# Altium schematic sheet Sheet_Connect.SchDoc
size A2
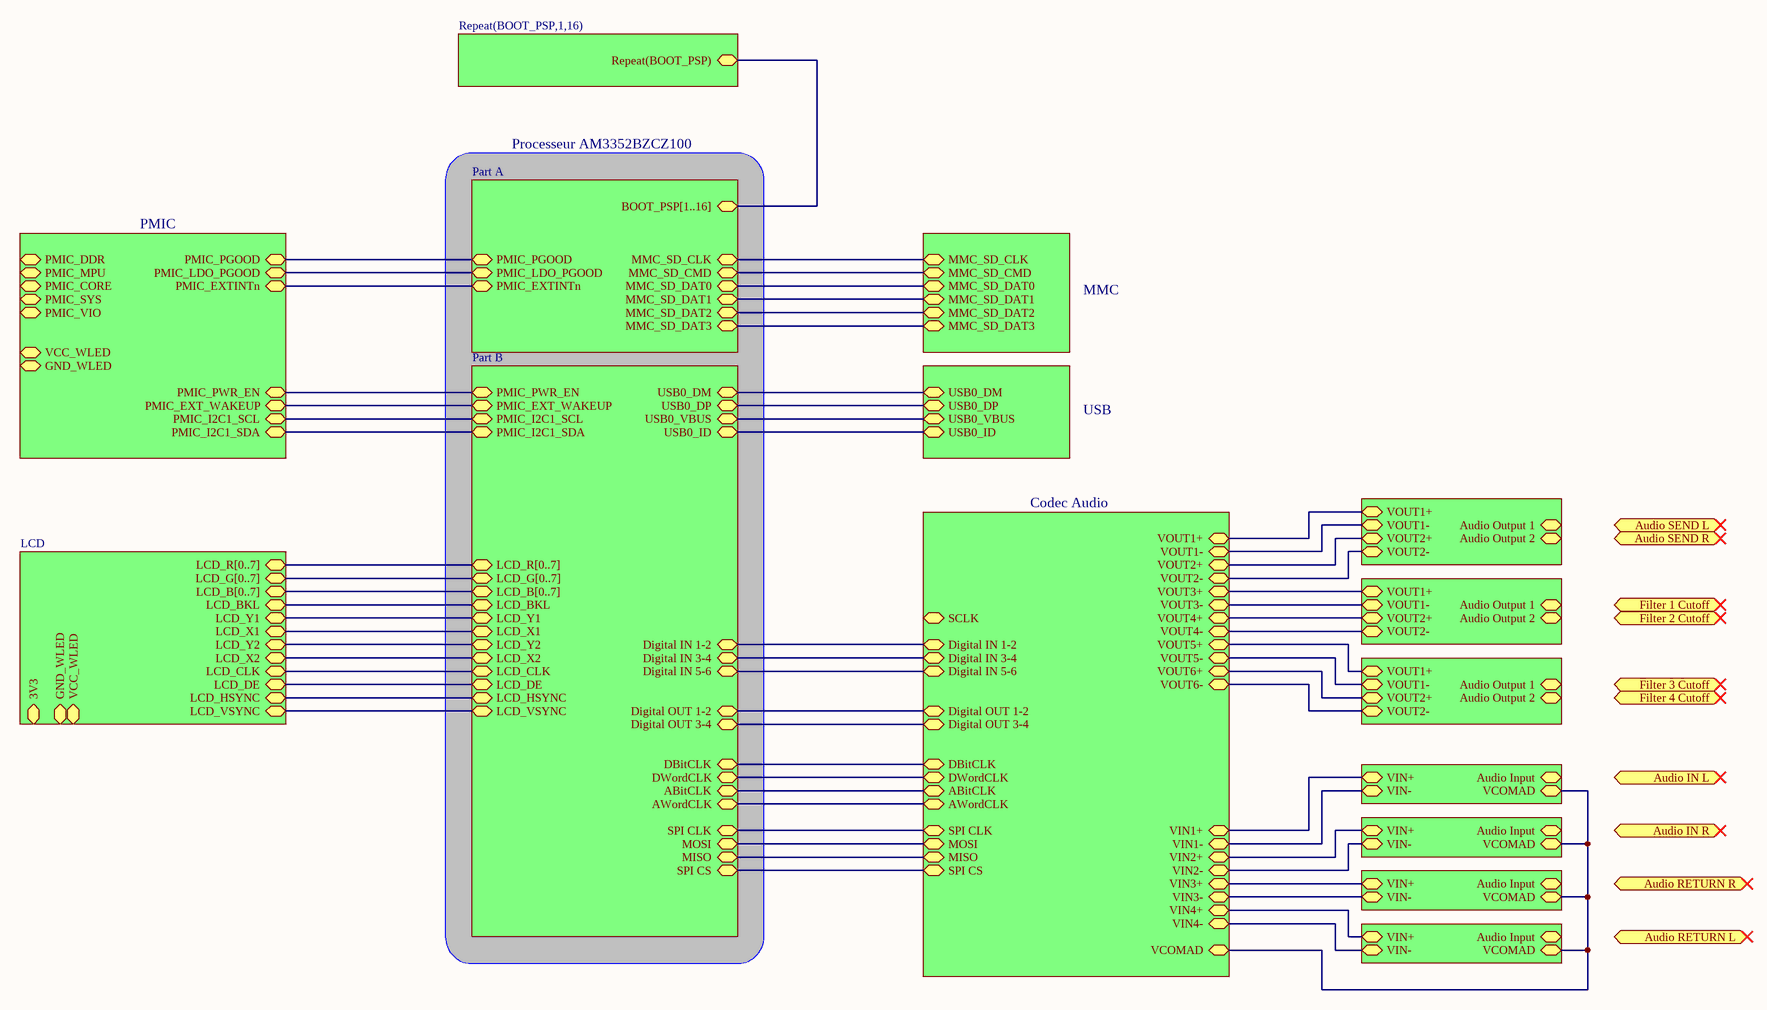
[diagram p0: Sheet_Connect.SchDoc]

## Sub-sheets
Audio Input L = Sh_Input.SchDoc: VIN+, VIN-, VCOMAD, Audio Input
Audio Input R = Sh_Input.SchDoc: VIN+, VIN-, VCOMAD, Audio Input
Audio Output = Sh_Output.SchDoc: VOUT1+, VOUT1-, VOUT2+, VOUT2-, Audio Output 1, Audio Output 2
Audio Output = Sh_Output.SchDoc: VOUT1+, VOUT1-, VOUT2+, VOUT2-, Audio Output 1, Audio Output 2
Audio Output = Sh_Output.SchDoc: VOUT1+, VOUT1-, VOUT2+, VOUT2-, Audio Output 1, Audio Output 2
Audio Repeat L = Sh_Input.SchDoc: VIN+, VIN-, VCOMAD, Audio Input
Audio Repeat R = Sh_Input.SchDoc: VIN+, VIN-, VCOMAD, Audio Input
Codec Audio = Sh_ADC-DAC_Main.SchDoc: VOUT1+, VOUT1-, VOUT2+, VOUT2-, VOUT3+, VOUT3-, VOUT4+, VOUT4-, VOUT5+, VOUT5-, VOUT6+, VOUT6-, VIN1+, VIN1-, VIN2+, VIN2-, VIN3+, VIN3-, VIN4+, VIN4-, VCOMAD, SCLK, Digital IN 1-2, Digital IN 3-4, Digital IN 5-6, Digital OUT 1-2, Digital OUT 3-4, DBitCLK, DWordCLK, ABitCLK, AWordCLK, SPI CLK, MOSI, MISO, SPI CS
LCD = LCD.SchDoc: 3V3, LCD_R[0..7], LCD_G[0..7], LCD_B[0..7], LCD_BKL, LCD_Y1, LCD_X1, LCD_Y2, LCD_X2, LCD_CLK, LCD_DE, GND_WLED, VCC_WLED, LCD_HSYNC, LCD_VSYNC
MMC = PROC_partA_(SRAM,NAND,LCD).SchDoc: MMC_SD_CMD, MMC_SD_DAT0, MMC_SD_DAT1, MMC_SD_DAT2, MMC_SD_DAT3, MMC_SD_CLK
Part A = PROC_partA_(SRAM,NAND,LCD).SchDoc: PMIC_PGOOD, PMIC_LDO_PGOOD, PMIC_EXTINTn, MMC_SD_CLK, MMC_SD_CMD, MMC_SD_DAT0, MMC_SD_DAT1, MMC_SD_DAT2, MMC_SD_DAT3, BOOT_PSP[1..16]
Part B = PROC_partB_(LCD).SchDoc: PMIC_EXT_WAKEUP, PMIC_PWR_EN, PMIC_I2C1_SCL, PMIC_I2C1_SDA, USB0_DM, USB0_DP, USB0_VBUS, USB0_ID, LCD_R[0..7], LCD_G[0..7], LCD_B[0..7], LCD_BKL, LCD_Y1, LCD_X1, LCD_Y2, LCD_X2, LCD_CLK, LCD_DE, LCD_HSYNC, LCD_VSYNC, Digital IN 1-2, Digital IN 3-4, Digital IN 5-6, Digital OUT 1-2, Digital OUT 3-4, DBitCLK, DWordCLK, ABitCLK, AWordCLK, SPI CLK, MOSI, MISO, SPI CS
PMIC = PMIC.SchDoc: PMIC_DDR, PMIC_MPU, PMIC_CORE, PMIC_SYS, PMIC_VIO, PMIC_PGOOD, PMIC_LDO_PGOOD, PMIC_EXTINTn, PMIC_EXT_WAKEUP, PMIC_PWR_EN, PMIC_I2C1_SCL, PMIC_I2C1_SDA, VCC_WLED, GND_WLED
Repeat(BOOT_PSP,1,16) = BOOT.SchDoc: Repeat(BOOT_PSP)
USB = Sh_USB.SchDoc: USB0_DM, USB0_DP, USB0_VBUS, USB0_ID

## Ports
Audio IN L (out), Audio IN R (out), Audio RETURN L (out), Audio RETURN R (out), Audio SEND L (out), Audio SEND R (out), Filter 1 Cutoff (out), Filter 2 Cutoff (out), Filter 3 Cutoff (out), Filter 4 Cutoff (out)

## Nets
(unnamed): sheet Part A/PMIC_PGOOD, sheet PMIC/PMIC_PGOOD
(unnamed): sheet Part A/PMIC_LDO_PGOOD, sheet PMIC/PMIC_LDO_PGOOD
(unnamed): sheet Part A/PMIC_EXTINTn, sheet PMIC/PMIC_EXTINTn
(unnamed): sheet Part A/MMC_SD_CLK, sheet MMC/MMC_SD_CLK
(unnamed): sheet Part A/MMC_SD_CMD, sheet MMC/MMC_SD_CMD
(unnamed): sheet Part A/MMC_SD_DAT0, sheet MMC/MMC_SD_DAT0
(unnamed): sheet Part A/MMC_SD_DAT1, sheet MMC/MMC_SD_DAT1
(unnamed): sheet Part A/MMC_SD_DAT2, sheet MMC/MMC_SD_DAT2
(unnamed): sheet Part A/MMC_SD_DAT3, sheet MMC/MMC_SD_DAT3
(unnamed): sheet Part A/BOOT_PSP[1..16], sheet Repeat(BOOT_PSP,1,16)/Repeat(BOOT_PSP)
(unnamed): sheet Part B/PMIC_EXT_WAKEUP, sheet PMIC/PMIC_EXT_WAKEUP
(unnamed): sheet Part B/PMIC_PWR_EN, sheet PMIC/PMIC_PWR_EN
(unnamed): sheet Part B/PMIC_I2C1_SCL, sheet PMIC/PMIC_I2C1_SCL
(unnamed): sheet Part B/PMIC_I2C1_SDA, sheet PMIC/PMIC_I2C1_SDA
(unnamed): sheet Part B/USB0_DM, sheet USB/USB0_DM
(unnamed): sheet Part B/USB0_DP, sheet USB/USB0_DP
(unnamed): sheet Part B/USB0_VBUS, sheet USB/USB0_VBUS
(unnamed): sheet Part B/USB0_ID, sheet USB/USB0_ID
(unnamed): sheet Part B/LCD_R[0..7], sheet LCD/LCD_R[0..7]
(unnamed): sheet Part B/LCD_G[0..7], sheet LCD/LCD_G[0..7]
(unnamed): sheet Part B/LCD_B[0..7], sheet LCD/LCD_B[0..7]
(unnamed): sheet Part B/LCD_BKL, sheet LCD/LCD_BKL
(unnamed): sheet Part B/LCD_Y1, sheet LCD/LCD_Y1
(unnamed): sheet Part B/LCD_X1, sheet LCD/LCD_X1
(unnamed): sheet Part B/LCD_Y2, sheet LCD/LCD_Y2
(unnamed): sheet Part B/LCD_X2, sheet LCD/LCD_X2
(unnamed): sheet Part B/LCD_CLK, sheet LCD/LCD_CLK
(unnamed): sheet Part B/LCD_DE, sheet LCD/LCD_DE
(unnamed): sheet Part B/LCD_HSYNC, sheet LCD/LCD_HSYNC
(unnamed): sheet Part B/LCD_VSYNC, sheet LCD/LCD_VSYNC
(unnamed): sheet Part B/Digital IN 1-2, sheet Codec Audio/Digital IN 1-2
(unnamed): sheet Part B/Digital IN 3-4, sheet Codec Audio/Digital IN 3-4
(unnamed): sheet Part B/Digital IN 5-6, sheet Codec Audio/Digital IN 5-6
(unnamed): sheet Part B/Digital OUT 1-2, sheet Codec Audio/Digital OUT 1-2
(unnamed): sheet Part B/Digital OUT 3-4, sheet Codec Audio/Digital OUT 3-4
(unnamed): sheet Part B/DBitCLK, sheet Codec Audio/DBitCLK
(unnamed): sheet Part B/DWordCLK, sheet Codec Audio/DWordCLK
(unnamed): sheet Part B/ABitCLK, sheet Codec Audio/ABitCLK
(unnamed): sheet Part B/AWordCLK, sheet Codec Audio/AWordCLK
(unnamed): sheet Part B/SPI CLK, sheet Codec Audio/SPI CLK
(unnamed): sheet Part B/MOSI, sheet Codec Audio/MOSI
(unnamed): sheet Part B/MISO, sheet Codec Audio/MISO
(unnamed): sheet Part B/SPI CS, sheet Codec Audio/SPI CS
(unnamed): sheet Codec Audio/VOUT1+, sheet Audio Output/VOUT1+
(unnamed): sheet Codec Audio/VOUT1-, sheet Audio Output/VOUT1-
(unnamed): sheet Codec Audio/VOUT2+, sheet Audio Output/VOUT2+
(unnamed): sheet Codec Audio/VOUT2-, sheet Audio Output/VOUT2-
(unnamed): sheet Codec Audio/VOUT3+, sheet Audio Output/VOUT1+
(unnamed): sheet Codec Audio/VOUT3-, sheet Audio Output/VOUT1-
(unnamed): sheet Codec Audio/VOUT4+, sheet Audio Output/VOUT2+
(unnamed): sheet Codec Audio/VOUT4-, sheet Audio Output/VOUT2-
(unnamed): sheet Codec Audio/VOUT5+, sheet Audio Output/VOUT1+
(unnamed): sheet Codec Audio/VOUT5-, sheet Audio Output/VOUT1-
(unnamed): sheet Codec Audio/VOUT6+, sheet Audio Output/VOUT2+
(unnamed): sheet Codec Audio/VOUT6-, sheet Audio Output/VOUT2-
(unnamed): sheet Codec Audio/VIN1+, sheet Audio Input L/VIN+
(unnamed): sheet Codec Audio/VIN1-, sheet Audio Input L/VIN-
(unnamed): sheet Codec Audio/VIN2+, sheet Audio Input R/VIN+
(unnamed): sheet Codec Audio/VIN2-, sheet Audio Input R/VIN-
(unnamed): sheet Codec Audio/VIN3+, sheet Audio Repeat L/VIN+
(unnamed): sheet Codec Audio/VIN3-, sheet Audio Repeat L/VIN-
(unnamed): sheet Codec Audio/VIN4+, sheet Audio Repeat R/VIN+
(unnamed): sheet Codec Audio/VIN4-, sheet Audio Repeat R/VIN-
(unnamed): sheet Codec Audio/VCOMAD, sheet Audio Input L/VCOMAD, sheet Audio Input R/VCOMAD, sheet Audio Repeat L/VCOMAD, sheet Audio Repeat R/VCOMAD

## Notes on the sheet
- Processeur AM3352BZCZ100